# Altium project ld_harness.PrjPcb
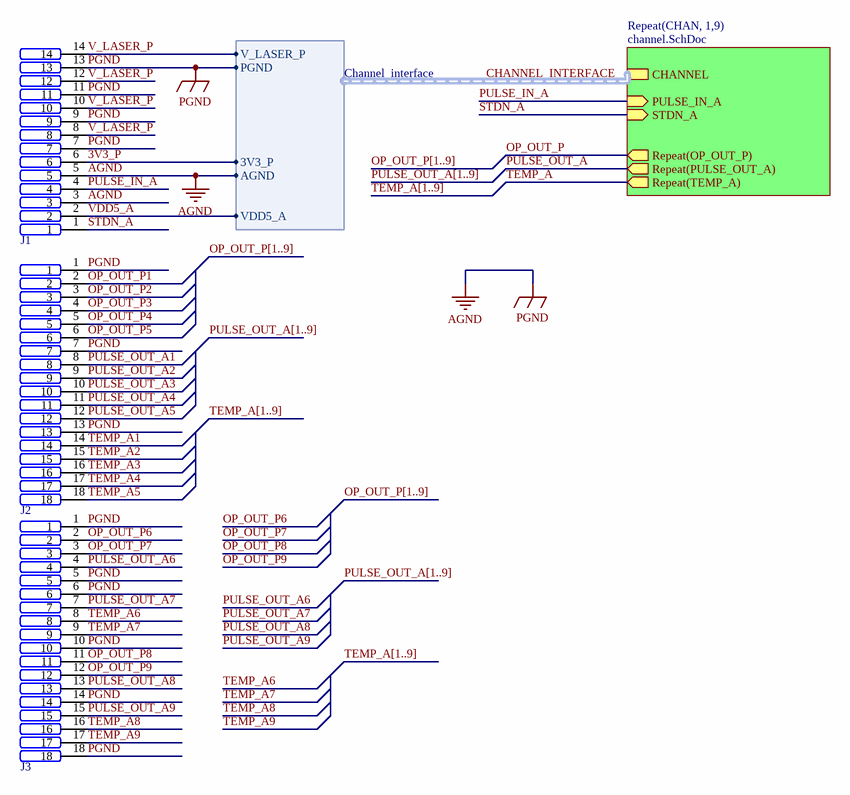
[diagram p0: main.SchDoc]
Author: villanif; CheckedBy: liuxian; LAB: IIS; Laboratory: =LAB; ProjectTitle: HELIOS-R; Revision: 1
2 sheets, 21 parts. Net scope: hierarchical (ports join the sheet entries above them; power ports are global).
Board file: ld_harness.PcbDoc
Sheets:
  main.SchDoc
    CHAN1 = channel.SchDoc
    CHAN2 = channel.SchDoc
    CHAN3 = channel.SchDoc
    CHAN4 = channel.SchDoc
    CHAN5 = channel.SchDoc
    CHAN6 = channel.SchDoc
    CHAN7 = channel.SchDoc
    CHAN8 = channel.SchDoc
    CHAN9 = channel.SchDoc

## Sheet main.SchDoc: LD_Harness
size A4; Date: 04.08.2023; CompanyName: IIS; DrawnBy: villanif; Engineer: villanif; Organization: IIS; DocumentNumber: 1; SheetNumber: 1; SheetTotal: 2; FileInfo: main.SchDoc

### Parts
J1  FPC_conn  [FPC_connector_14_1mm]  (value not drawn)  (no BOM)
J2  FPC_conn  [FPC_connector_18_0.5]  (value not drawn)  (no BOM)
J3  FPC_conn  [FPC_connector_18_0.5]  (value not drawn)  (no BOM)

### Sub-sheets
Repeat(CHAN, 1,9) = channel.SchDoc: CHANNEL (harness Channel_interface), Repeat(OP_OUT_P) (out), PULSE_IN_A (in), Repeat(PULSE_OUT_A) (out), STDN_A (in), Repeat(TEMP_A) (out)

### Harnesses
Channel_interface: VDD5_A, AGND, V_LASER_P, PGND, 3V3_P

### Nets
AGND: J1.3 J1.5 J1.7 J1.9 J1.11 J1.13 J2.1 J2.7 J2.13 J3.1 J3.5 J3.6 J3.10 J3.14 J3.18 ; sheet Repeat(CHAN, 1,9)/CHANNEL.AGND  [also labelled PGND]
3V3_P: J1.6 ; sheet Repeat(CHAN, 1,9)/CHANNEL.3V3_P
OP_OUT_P: sheet Repeat(CHAN, 1,9)/Repeat(OP_OUT_P)
OP_OUT_P1: J2.2
OP_OUT_P2: J2.3
OP_OUT_P3: J2.4
OP_OUT_P4: J2.5
OP_OUT_P5: J2.6
OP_OUT_P6: J3.2
OP_OUT_P7: J3.3
OP_OUT_P8: J3.11
OP_OUT_P9: J3.12
PULSE_IN_A: J1.4 ; sheet Repeat(CHAN, 1,9)/PULSE_IN_A
PULSE_OUT_A: sheet Repeat(CHAN, 1,9)/Repeat(PULSE_OUT_A)
PULSE_OUT_A1: J2.8
PULSE_OUT_A2: J2.9
PULSE_OUT_A3: J2.10
PULSE_OUT_A4: J2.11
PULSE_OUT_A5: J2.12
PULSE_OUT_A6: J3.4
PULSE_OUT_A7: J3.7
PULSE_OUT_A8: J3.13
PULSE_OUT_A9: J3.15
STDN_A: J1.1 ; sheet Repeat(CHAN, 1,9)/STDN_A
TEMP_A: sheet Repeat(CHAN, 1,9)/Repeat(TEMP_A)
TEMP_A1: J2.14
TEMP_A2: J2.15
TEMP_A3: J2.16
TEMP_A4: J2.17
TEMP_A5: J2.18
TEMP_A6: J3.8
TEMP_A7: J3.9
TEMP_A8: J3.16
TEMP_A9: J3.17
V_LASER_P: J1.8 J1.10 J1.12 J1.14 ; sheet Repeat(CHAN, 1,9)/CHANNEL.V_LASER_P  [project net CHANNEL_INTERFACE.V_LASER_P]
VDD5_A: J1.2 ; sheet Repeat(CHAN, 1,9)/CHANNEL.VDD5_A  [project net CHANNEL_INTERFACE.VDD5_A]

### Buses and harness runs
bus OP_OUT_P[1..9]
bus PULSE_OUT_A[1..9]
bus TEMP_A[1..9]
harness CHANNEL_INTERFACE = sheet Repeat(CHAN, 1,9)/CHANNEL

### Notes on the sheet
- Project:
- Laboratory:
- Date:
- File:
- Rev:
- Variation:
- Drawn By:
- Checked By:
- Sheet:
- /

### Library data of the parts
J1 = FPC_connector_1mm_14: Connector FPC, 14 pin, 1mm pitch
J2 J3 = FPC_connector: Connector FPC, 18 pin, 0.5mm pitch

## Sheet channel.SchDoc: Pulser Harness Channel
size A4; Date: 04.08.2023; CompanyName: IIS; DrawnBy: villanif; Engineer: villanif; Organization: IIS; DocumentNumber: 1; SheetNumber: 2; SheetTotal: 2; FileInfo: channel.SchDoc
Used 9 times, as channels CHAN1, CHAN2, CHAN3, CHAN4, CHAN5, CHAN6, CHAN7, CHAN8, CHAN9. Parts and nets are listed once, with the designators drawn on the sheet.
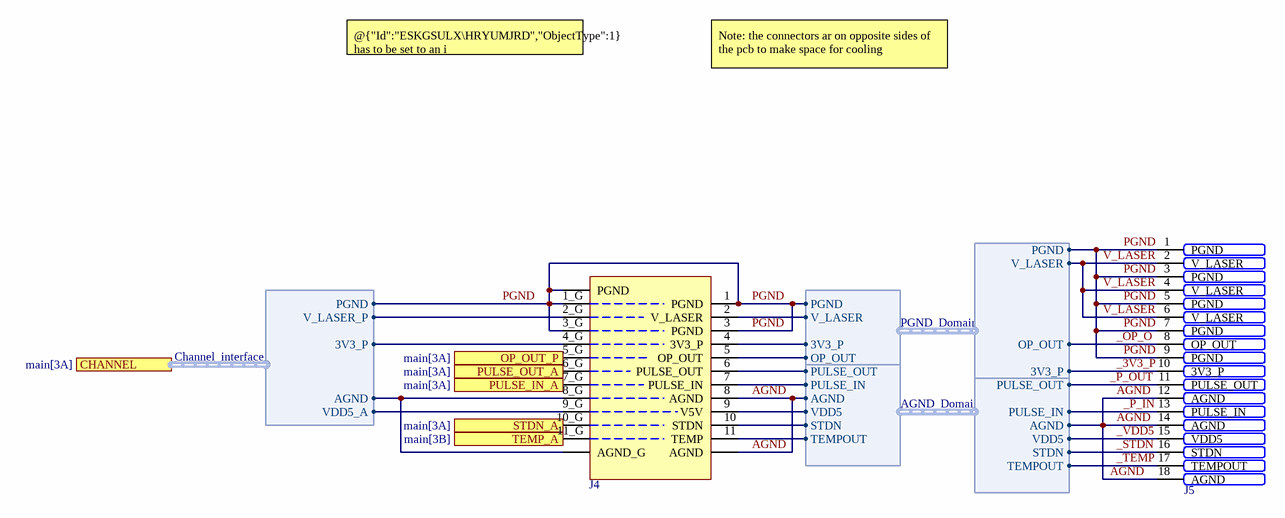
[diagram p1: channel.SchDoc]

### Parts
J4  LD_driver_footprint  [Driver_footprint]  (value not drawn)  (no BOM)
J5  FPC_conn  [FPC_connector_18_0.5]  (value not drawn)  (no BOM)

### Ports
CHANNEL (harness Channel_interface, see main[3A]), OP_OUT_P (out, see main[3A]), PULSE_IN_A (in, see main[3A]), PULSE_OUT_A (out, see main[3A]), STDN_A (in, see main[3A]), TEMP_A (out, see main[3B])

### Harnesses
PGND_Domain: V_LASER, PGND, 3V3_P, OP_OUT
AGND_Domain: VDD5, AGND, PULSE_IN, PULSE_OUT, STDN, TEMPOUT
Channel_interface: VDD5_A, AGND, V_LASER_P, PGND, 3V3_P

### Nets
_3V3_P: J4.4(3V3_P) J5.10(3V3_P) ; harness PGND_Domain.3V3_P
_OP_O: J4.5(OP_OUT) J5.8(OP_OUT) ; harness PGND_Domain.OP_OUT
_P_IN: J4.7(PULSE_IN) J5.13(PULSE_IN) ; harness AGND_Domain.PULSE_IN
_P_OUT: J4.6(PULSE_OUT) J5.11(PULSE_OUT) ; harness AGND_Domain.PULSE_OUT
_STDN: J4.10(STDN) J5.16(STDN) ; harness AGND_Domain.STDN
_TEMP: J4.11(TEMP) J5.17(TEMPOUT) ; harness AGND_Domain.TEMPOUT
_VDD5: J4.9(V5V) J5.15(VDD5) ; harness AGND_Domain.VDD5
AGND: J4.8(AGND) J4.AGND J5.12(AGND) J5.14(AGND) J5.18(AGND) ; harness AGND_Domain.AGND
OP_OUT_P: J4.5_G ; port OP_OUT_P
PGND: J4.1(PGND) J4.1_G J4.3(PGND) J4.3_G J4.PGND J5.1(PGND) J5.3(PGND) J5.5(PGND) J5.7(PGND) J5.9(PGND) ; harness PGND_Domain.PGND
PULSE_IN_A: J4.7_G ; port PULSE_IN_A
PULSE_OUT_A: J4.6_G ; port PULSE_OUT_A
STDN_A: J4.10_G ; port STDN_A
TEMP_A: J4.11_G ; port TEMP_A
V_LASER: J4.2(V_LASER) J5.2(V_LASER) J5.4(V_LASER) J5.6(V_LASER) ; harness PGND_Domain.V_LASER
NetJ4_2_G: J4.2_G ; port CHANNEL.V_LASER_P
NetJ4_4_G: J4.4_G ; port CHANNEL.3V3_P
NetJ4_8_G: J4.8_G J4.AGND_G ; port CHANNEL.AGND
NetJ4_9_G: J4.9_G ; port CHANNEL.VDD5_A

### Channels
CHAN1: designators end in _CHAN1; ports OP_OUT_P=OP_OUT_P1 PULSE_IN_A=PULSE_IN_A PULSE_OUT_A=PULSE_OUT_A1 STDN_A=STDN_A TEMP_A=TEMP_A1
CHAN2: designators end in _CHAN2; ports OP_OUT_P=OP_OUT_P2 PULSE_IN_A=PULSE_IN_A PULSE_OUT_A=PULSE_OUT_A2 STDN_A=STDN_A TEMP_A=TEMP_A2
CHAN3: designators end in _CHAN3; ports OP_OUT_P=OP_OUT_P3 PULSE_IN_A=PULSE_IN_A PULSE_OUT_A=PULSE_OUT_A3 STDN_A=STDN_A TEMP_A=TEMP_A3
CHAN4: designators end in _CHAN4; ports OP_OUT_P=OP_OUT_P4 PULSE_IN_A=PULSE_IN_A PULSE_OUT_A=PULSE_OUT_A4 STDN_A=STDN_A TEMP_A=TEMP_A4
CHAN5: designators end in _CHAN5; ports OP_OUT_P=OP_OUT_P5 PULSE_IN_A=PULSE_IN_A PULSE_OUT_A=PULSE_OUT_A5 STDN_A=STDN_A TEMP_A=TEMP_A5
CHAN6: designators end in _CHAN6; ports OP_OUT_P=OP_OUT_P6 PULSE_IN_A=PULSE_IN_A PULSE_OUT_A=PULSE_OUT_A6 STDN_A=STDN_A TEMP_A=TEMP_A6
CHAN7: designators end in _CHAN7; ports OP_OUT_P=OP_OUT_P7 PULSE_IN_A=PULSE_IN_A PULSE_OUT_A=PULSE_OUT_A7 STDN_A=STDN_A TEMP_A=TEMP_A7
CHAN8: designators end in _CHAN8; ports OP_OUT_P=OP_OUT_P8 PULSE_IN_A=PULSE_IN_A PULSE_OUT_A=PULSE_OUT_A8 STDN_A=STDN_A TEMP_A=TEMP_A8
CHAN9: designators end in _CHAN9; ports OP_OUT_P=OP_OUT_P9 PULSE_IN_A=PULSE_IN_A PULSE_OUT_A=PULSE_OUT_A9 STDN_A=STDN_A TEMP_A=TEMP_A9

### Notes on the sheet
- @{"Id":"ESKGSULX\HRYUMJRD","ObjectType":1} has to be set to an i
- Note: the connectors ar on opposite sides of the pcb to make space for cooling
- Project:
- Laboratory:
- Date:
- File:
- Rev:
- Variation:
- Drawn By:
- Checked By:
- Sheet:
- /

### Library data of the parts
J4 = LD_Driver: footprint LD driver
J5 = FPC_connector_pulser: Connector FPC, 18 pin, 0.5mm pitch

## Nets that join several sheets
AGND: main (15 pins), CHAN1 (J4_CHAN1.8_G J4_CHAN1.AGND_G), CHAN2 (J4_CHAN2.8_G J4_CHAN2.AGND_G), CHAN3 (J4_CHAN3.8_G J4_CHAN3.AGND_G), CHAN4 (J4_CHAN4.8_G J4_CHAN4.AGND_G), CHAN5 (J4_CHAN5.8_G J4_CHAN5.AGND_G), CHAN6 (J4_CHAN6.8_G J4_CHAN6.AGND_G), CHAN7 (J4_CHAN7.8_G J4_CHAN7.AGND_G), CHAN8 (J4_CHAN8.8_G J4_CHAN8.AGND_G), CHAN9 (J4_CHAN9.8_G J4_CHAN9.AGND_G)
3V3_P: main (J1.6), CHAN1 (J4_CHAN1.4_G), CHAN2 (J4_CHAN2.4_G), CHAN3 (J4_CHAN3.4_G), CHAN4 (J4_CHAN4.4_G), CHAN5 (J4_CHAN5.4_G), CHAN6 (J4_CHAN6.4_G), CHAN7 (J4_CHAN7.4_G), CHAN8 (J4_CHAN8.4_G), CHAN9 (J4_CHAN9.4_G)
CHANNEL_INTERFACE.V_LASER_P: main (J1.8 J1.10 J1.12 J1.14), CHAN1 (J4_CHAN1.2_G), CHAN2 (J4_CHAN2.2_G), CHAN3 (J4_CHAN3.2_G), CHAN4 (J4_CHAN4.2_G), CHAN5 (J4_CHAN5.2_G), CHAN6 (J4_CHAN6.2_G), CHAN7 (J4_CHAN7.2_G), CHAN8 (J4_CHAN8.2_G), CHAN9 (J4_CHAN9.2_G)
CHANNEL_INTERFACE.VDD5_A: main (J1.2), CHAN1 (J4_CHAN1.9_G), CHAN2 (J4_CHAN2.9_G), CHAN3 (J4_CHAN3.9_G), CHAN4 (J4_CHAN4.9_G), CHAN5 (J4_CHAN5.9_G), CHAN6 (J4_CHAN6.9_G), CHAN7 (J4_CHAN7.9_G), CHAN8 (J4_CHAN8.9_G), CHAN9 (J4_CHAN9.9_G)
OP_OUT_P1: main (J2.2), CHAN1 (J4_CHAN1.5_G)
OP_OUT_P2: main (J2.3), CHAN2 (J4_CHAN2.5_G)
OP_OUT_P3: main (J2.4), CHAN3 (J4_CHAN3.5_G)
OP_OUT_P4: main (J2.5), CHAN4 (J4_CHAN4.5_G)
OP_OUT_P5: main (J2.6), CHAN5 (J4_CHAN5.5_G)
OP_OUT_P6: main (J3.2), CHAN6 (J4_CHAN6.5_G)
OP_OUT_P7: main (J3.3), CHAN7 (J4_CHAN7.5_G)
OP_OUT_P8: main (J3.11), CHAN8 (J4_CHAN8.5_G)
OP_OUT_P9: main (J3.12), CHAN9 (J4_CHAN9.5_G)
PULSE_IN_A: main (J1.4), CHAN1 (J4_CHAN1.7_G), CHAN2 (J4_CHAN2.7_G), CHAN3 (J4_CHAN3.7_G), CHAN4 (J4_CHAN4.7_G), CHAN5 (J4_CHAN5.7_G), CHAN6 (J4_CHAN6.7_G), CHAN7 (J4_CHAN7.7_G), CHAN8 (J4_CHAN8.7_G), CHAN9 (J4_CHAN9.7_G)
PULSE_OUT_A1: main (J2.8), CHAN1 (J4_CHAN1.6_G)
PULSE_OUT_A2: main (J2.9), CHAN2 (J4_CHAN2.6_G)
PULSE_OUT_A3: main (J2.10), CHAN3 (J4_CHAN3.6_G)
PULSE_OUT_A4: main (J2.11), CHAN4 (J4_CHAN4.6_G)
PULSE_OUT_A5: main (J2.12), CHAN5 (J4_CHAN5.6_G)
PULSE_OUT_A6: main (J3.4), CHAN6 (J4_CHAN6.6_G)
PULSE_OUT_A7: main (J3.7), CHAN7 (J4_CHAN7.6_G)
PULSE_OUT_A8: main (J3.13), CHAN8 (J4_CHAN8.6_G)
PULSE_OUT_A9: main (J3.15), CHAN9 (J4_CHAN9.6_G)
STDN_A: main (J1.1), CHAN1 (J4_CHAN1.10_G), CHAN2 (J4_CHAN2.10_G), CHAN3 (J4_CHAN3.10_G), CHAN4 (J4_CHAN4.10_G), CHAN5 (J4_CHAN5.10_G), CHAN6 (J4_CHAN6.10_G), CHAN7 (J4_CHAN7.10_G), CHAN8 (J4_CHAN8.10_G), CHAN9 (J4_CHAN9.10_G)
TEMP_A1: main (J2.14), CHAN1 (J4_CHAN1.11_G)
TEMP_A2: main (J2.15), CHAN2 (J4_CHAN2.11_G)
TEMP_A3: main (J2.16), CHAN3 (J4_CHAN3.11_G)
TEMP_A4: main (J2.17), CHAN4 (J4_CHAN4.11_G)
TEMP_A5: main (J2.18), CHAN5 (J4_CHAN5.11_G)
TEMP_A6: main (J3.8), CHAN6 (J4_CHAN6.11_G)
TEMP_A7: main (J3.9), CHAN7 (J4_CHAN7.11_G)
TEMP_A8: main (J3.16), CHAN8 (J4_CHAN8.11_G)
TEMP_A9: main (J3.17), CHAN9 (J4_CHAN9.11_G)